# Altium project ePBR23_ACU_Latching.PrjPCB (part 1 of 2)
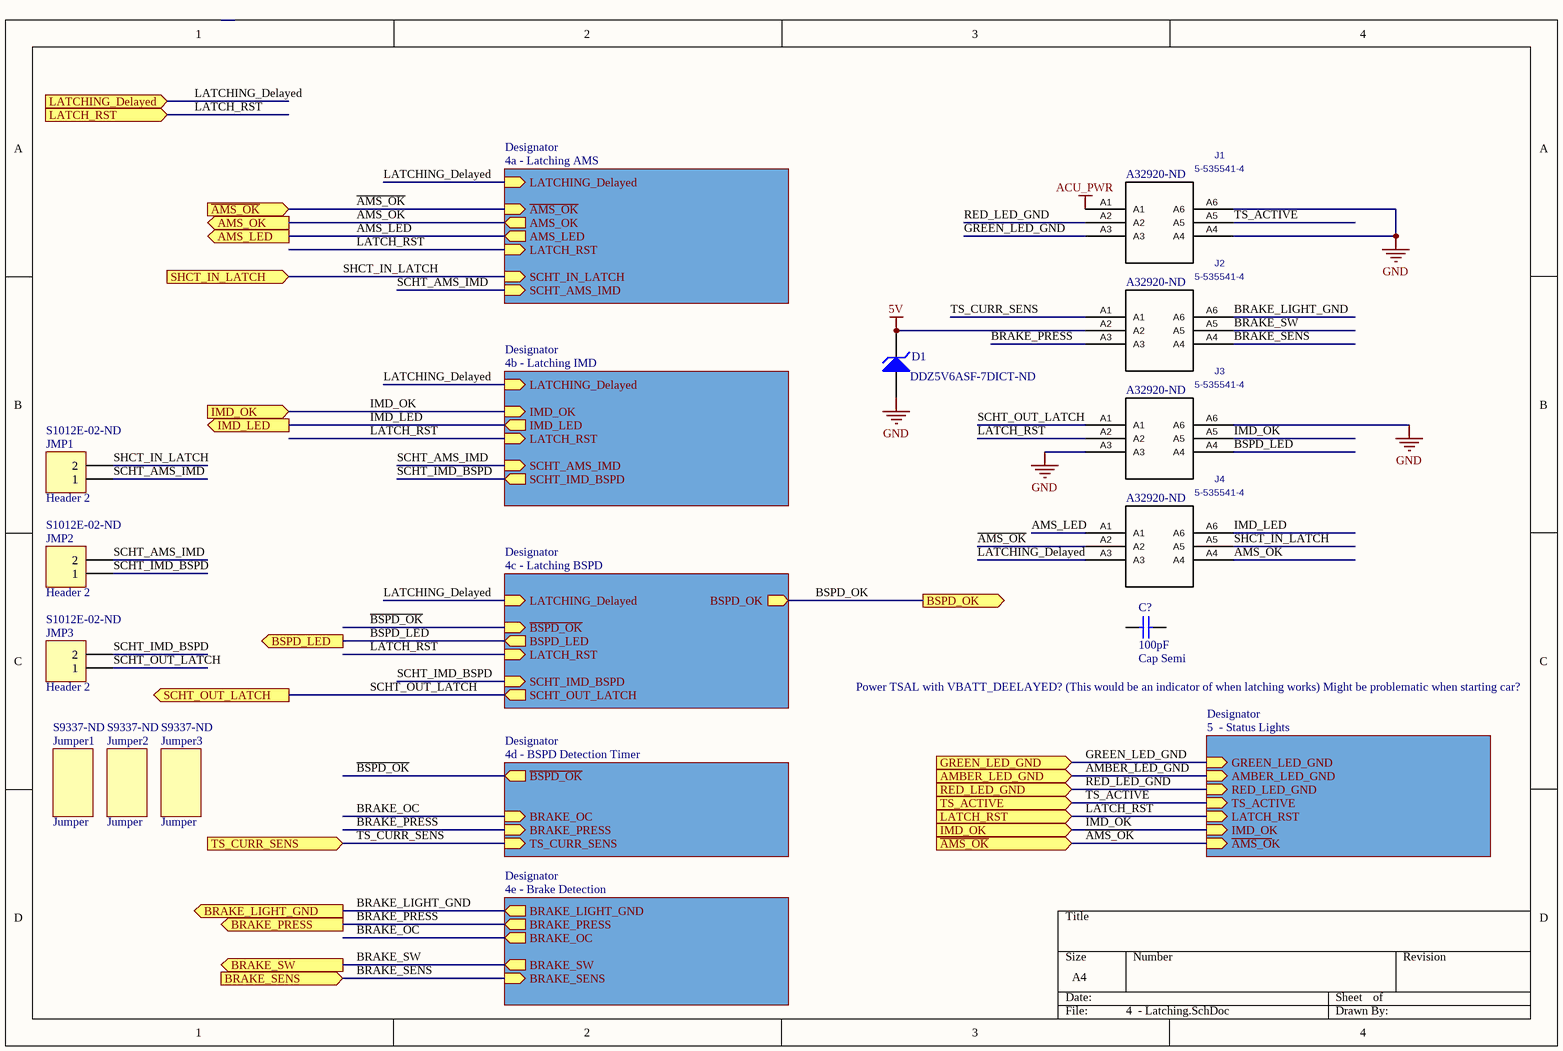
[diagram p0: 4  - Latching.SchDoc]
7 sheets, 102 parts. Net scope: hierarchical (ports join the sheet entries above them; power ports are global).
Board files: ePBR23_ACU_Latching_rev0.PcbDoc, ePBR20_ACU_Latching_rev0.PcbDoc
Sheets:
  4  - Latching.SchDoc
    Designator = 4b - Latching IMD.SchDoc
    Designator = 4c - Latching BSPD.SchDoc
    Designator = 4a - Latching AMS.SchDoc
    Designator = 4d - BSPD Detection Timer.SchDoc
    Designator = 4e - Brake Detection.SchDoc
  5  - TSAL.SchDoc

## Sheet 4  - Latching.SchDoc
size A4

### Parts
C?  Cap Semi  value 100pF  [1608[0603]]
D1  Supplier Part Number 1: DDZ5V6ASF-7DICT-ND  [DIODE_SOD323_101]  (hidden comment: D Zener)
J1  5-535541-4  Supplier Part Number 1: A32920-ND  [5-535541-4_5-535541-4(Primary)]
J2  5-535541-4  Supplier Part Number 1: A32920-ND  [5-535541-4_5-535541-4(Primary)]
J3  5-535541-4  Supplier Part Number 1: A32920-ND  [5-535541-4_5-535541-4(Primary)]
J4  5-535541-4  Supplier Part Number 1: A32920-ND  [5-535541-4_5-535541-4(Primary)]
JMP1  Header 2  Supplier Part Number 1: S1012E-02-ND  [2Pin Jumper]
JMP2  Header 2  Supplier Part Number 1: S1012E-02-ND  [2Pin Jumper]
JMP3  Header 2  Supplier Part Number 1: S1012E-02-ND  [2Pin Jumper]
Jumper1  Jumper  Supplier Part Number 1: S9337-ND
Jumper2  Jumper  Supplier Part Number 1: S9337-ND
Jumper3  Jumper  Supplier Part Number 1: S9337-ND

### Sub-sheets
Designator = 4b - Latching IMD: LATCHING_Delayed (in), IMD_LED (out), LATCH_RST (in), SCHT_AMS_IMD (in), SCHT_IMD_BSPD (out), IMD_OK (in)
Designator = 4c - Latching BSPD: LATCHING_Delayed (in), BSPD_LED (out), LATCH_RST (in), SCHT_IMD_BSPD (in), SCHT_OUT_LATCH (out), ~{BSPD_OK} (in), BSPD_OK (out)
Designator = 4a - Latching AMS: LATCHING_Delayed (in), ~{AMS_OK} (in), AMS_LED (out), LATCH_RST (in), SCHT_IN_LATCH (in), SCHT_AMS_IMD (in), AMS_OK (out)
Designator = 4d - BSPD Detection Timer: ~{BSPD_OK} (out), TS_CURR_SENS (in), BRAKE_PRESS (in), BRAKE_OC (in)
Designator = 4e - Brake Detection: BRAKE_LIGHT_GND (out), BRAKE_PRESS (out), BRAKE_SENS (in), BRAKE_OC (out), BRAKE_SW (out)
Designator = 5  - Status Lights (file not in this document): RED_LED_GND (in), TS_ACTIVE (in), LATCH_RST (in), AMBER_LED_GND (in), GREEN_LED_GND (in), IMD_OK (in), ~{AMS_O}K (in)

### Ports
AMBER_LED_GND (in), AMS_LED (out), AMS_OK (out), BRAKE_LIGHT_GND (out), BRAKE_PRESS (out), BRAKE_SENS (in), BRAKE_SW (out), BSPD_LED (out), BSPD_OK (out), GREEN_LED_GND (in), IMD_LED (out), IMD_OK (in), LATCH_RST (in), LATCHING_Delayed (in), RED_LED_GND (in), SCHT_OUT_LATCH (out), SHCT_IN_LATCH (in), TS_ACTIVE (in), TS_CURR_SENS (in), ~{AMS_OK} (in)

### Nets
5V: D1.2(K) J2.A2
ACU_PWR: J1.A1
GND: D1.1(A) J1.A4 J1.A6 J3.A3 J3.A6
LATCHING_Delayed: J4.A3 ; port LATCHING_Delayed, sheet Designator/LATCHING_Delayed, sheet Designator/LATCHING_Delayed, sheet Designator/LATCHING_Delayed
~{AMS_OK}: J4.A2 ; port ~{AMS_OK}, sheet Designator/~{AMS_OK}, sheet Designator/~{AMS_O}K
AMBER_LED_GND: port AMBER_LED_GND, sheet Designator/AMBER_LED_GND
AMS_LED: J4.A1 ; port AMS_LED, sheet Designator/AMS_LED
AMS_OK: J4.A4 ; port AMS_OK, sheet Designator/AMS_OK
~{BSPD_OK}: sheet Designator/~{BSPD_OK}, sheet Designator/~{BSPD_OK}
BRAKE_LIGHT_GND: J2.A6 ; port BRAKE_LIGHT_GND, sheet Designator/BRAKE_LIGHT_GND
BRAKE_OC: sheet Designator/BRAKE_OC, sheet Designator/BRAKE_OC
BRAKE_PRESS: J2.A3 ; port BRAKE_PRESS, sheet Designator/BRAKE_PRESS, sheet Designator/BRAKE_PRESS
BRAKE_SENS: J2.A4 ; port BRAKE_SENS, sheet Designator/BRAKE_SENS
BRAKE_SW: J2.A5 ; port BRAKE_SW, sheet Designator/BRAKE_SW
BSPD_LED: J3.A4 ; port BSPD_LED, sheet Designator/BSPD_LED
BSPD_OK: port BSPD_OK, sheet Designator/BSPD_OK
GREEN_LED_GND: J1.A3 ; port GREEN_LED_GND, sheet Designator/GREEN_LED_GND
IMD_LED: J4.A6 ; port IMD_LED, sheet Designator/IMD_LED
IMD_OK: J3.A5 ; port IMD_OK, sheet Designator/IMD_OK, sheet Designator/IMD_OK
LATCH_RST: J3.A2 ; port LATCH_RST, sheet Designator/LATCH_RST, sheet Designator/LATCH_RST, sheet Designator/LATCH_RST, sheet Designator/LATCH_RST
RED_LED_GND: J1.A2 ; port RED_LED_GND, sheet Designator/RED_LED_GND
SCHT_AMS_IMD: JMP1.1 JMP2.2 ; sheet Designator/SCHT_AMS_IMD, sheet Designator/SCHT_AMS_IMD
SCHT_IMD_BSPD: JMP2.1 JMP3.2 ; sheet Designator/SCHT_IMD_BSPD, sheet Designator/SCHT_IMD_BSPD
SCHT_OUT_LATCH: J3.A1 JMP3.1 ; port SCHT_OUT_LATCH, sheet Designator/SCHT_OUT_LATCH
SHCT_IN_LATCH: J4.A5 JMP1.2 ; port SHCT_IN_LATCH, sheet Designator/SCHT_IN_LATCH  [project net SCHT_IN_LATCH]
TS_ACTIVE: J1.A5 ; port TS_ACTIVE, sheet Designator/TS_ACTIVE
TS_CURR_SENS: J2.A1 ; port TS_CURR_SENS, sheet Designator/TS_CURR_SENS

Not connected (* = marked no-connect by the designer): C? 1 2

### Notes on the sheet
- Power TSAL with VBATT_DEELAYED? (This would be an indicator of when latching works) Might be problematic when starting car?

### Library data of the parts
C? = Cap Semi: Capacitor (Semiconductor SIM Model); Published: 8-Jun-2000; LatestRevisionDate: 29-May-2009; LatestRevisionNote: IPC-7351 Footprint Added.; PackageReference: C1206; Publisher: Altium Limited; PackageDescription: Chip Capacitor
D1 = D Zener: Zener Diode; Published: 8-Jun-2000; LatestRevisionDate: 17-Jul-2002; LatestRevisionNote: Re-released for DXP Platform.; PackageReference: DIODE-0.7; Publisher: Altium Limited; PackageDescription: Diode, Thru-Hole; 2 Leads; 0.7 in Pin Spacing; Supplier 1: Digi-Key
J1-J4 = 5-535541-4: C: Copyright (C) 2015 Accelerated Designs. All rights reserved; Vendor: TE Connectivity; Built_By: EMA_UL_Team; Value: 5-535541-4; Manufacturer_Part_Number: 5-535541-4; Supplier 1: Digi-Key
JMP1-JMP3 = Header 2: Header, 2-Pin; Manufacturer: Harwin Inc.; Manufacturer Part Number: M20-9990246; Connector Type: Header, Cuttable; Pitch - Mating: 0.100" (2.54mm); Style: Board to Board or Cable; Shrouding: Unshrouded; Number of Positions: 2; Number of Positions Loaded: All; Contact Length - Mating: 0.240" (6.10mm); Contact Length - Post: 0.118" (3.00mm); Overall Contact Length: 0.460" (11.68mm); Material Flammability Rating: UL94 V-0; Current Rating: 3A per Contact; Mated Stacking Heights: 10.04mm, 10.64mm, 11.04mm, 16.54mm; LatestRevisionDate: 17-Jul-2002; LatestRevisionNote: Re-released for DXP Platform.; Publisher: Altium Limited; RoHS: RoHS Compliant; Category: Connectors, Interconnects; Packaging: Bulk; Part Status: Active; Contact Type: Male Pin; Number of Rows: 1; Row Spacing - Mating: -; Mounting Type: Through Hole; Termination: Solder; Fastening Type: Push-Pull; Insulation Height: 0.100" (2.54mm); Contact Shape: Square; Contact Finish - Mating: Tin; Contact Finish Thickness - Mating: -; Contact Finish - Post: Tin; Contact Material: Brass; Insulation Material: Polyamide (PA6T), Nylon 6T; Features: -; Operating Temperature: -40°C ~ 105°C; Ingress Protection: -; Insulation Color: Black; Voltage Rating: -; Contact Finish Thickness - Post: -; Applications: -; ComponentLink1URL: https://cdn.harwin.com/pdfs/M20-999.pdf; ComponentLink1Description: https://cdn.harwin.com/pdfs/M20-999.pdf; Supplier 1: Digi-Key
Jumper1-Jumper3 = Jumper: Supplier 1: Digi-Key

## Sheet 4b - Latching IMD.SchDoc
size A4
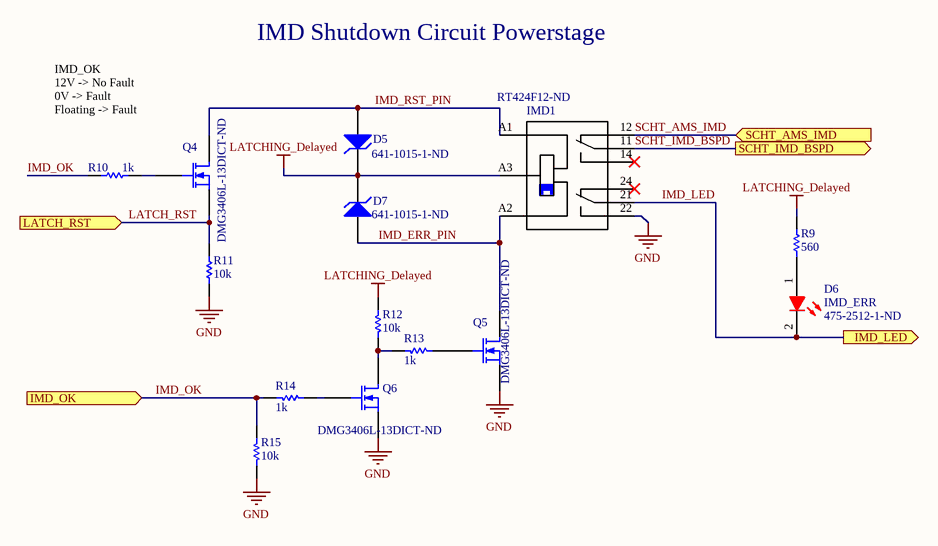
[diagram p1: 4b - Latching IMD.SchDoc]

### Parts
D5  Supplier Part Number 1: 641-1015-1-ND  [DO214AC]  (hidden comment: D Zener)
D6  IMD_ERR  Supplier Part Number 1: 475-2512-1-ND  [TOSH-0603LED_RED_V]
D7  Supplier Part Number 1: 641-1015-1-ND  [DO214AC]  (hidden comment: D Zener)
IMD1  Supplier Part Number 1: RT424F12-ND  [TE_5-1393243-4]  (hidden comment: 5-1393243-4)
Q4  Supplier Part Number 1: DMG3406L-13DICT-ND  [SOT-23_N]
Q5  Supplier Part Number 1: DMG3406L-13DICT-ND  [SOT-23_N]
Q6  Supplier Part Number 1: DMG3406L-13DICT-ND  [SOT-23_N]
R9  560  [RESC0603(1608)_L]
R10  value 1k  [1608[0603]]  (hidden comment: Res1)
R11  value 10k  [1608[0603]]  (hidden comment: Res1)
R12  Resistance (Ohms): 10k  [1608[0603]]  (hidden comment: RHM1.0KDCT-ND)
R13  value 1k  [1608[0603]]  (hidden comment: Res1)
R14  value 1k  [1608[0603]]  (hidden comment: Res1)
R15  value 10k  [1608[0603]]  (hidden comment: Res1)

### Ports
IMD_LED (out), IMD_OK (in), LATCH_RST (in), SCHT_AMS_IMD (in), SCHT_IMD_BSPD (out)

### Nets
GND: IMD1.22 Q5.2(S) Q6.2(S) R11.1 R15.2
LATCHING_Delayed: D5.2(K) D7.2(K) IMD1.A3 R9.2 R12.1
IMD_ERR_PIN: D7.1(A) IMD1.A2 Q5.3(D)
IMD_LED: D6.2(K) IMD1.21 ; port IMD_LED
IMD_OK: R10.1 R14.2 R15.1 ; port IMD_OK
IMD_RST_PIN: D5.1(A) IMD1.A1 Q4.3(D)
LATCH_RST: Q4.2(S) R11.2 ; port LATCH_RST
SCHT_AMS_IMD: IMD1.12 ; port SCHT_AMS_IMD
SCHT_IMD_BSPD: IMD1.11 ; port SCHT_IMD_BSPD
NetD6_1: D6.1(A) R9.1
NetQ4_1: Q4.1(G) R10.2
NetQ5_1: Q5.1(G) R13.1
NetQ6_1: Q6.1(G) R14.1
NetQ6_3: Q6.3(D) R12.2 R13.2

Not connected (* = marked no-connect by the designer): IMD1 14* 24*

### Notes on the sheet
- IMD Shutdown Circuit Powerstage
- IMD_OK
  12V -> No Fault
  0V -> Fault
  Floating -> Fault

### Library data of the parts
D5 D7 = D Zener: Zener Diode; Published: 8-Jun-2000; LatestRevisionDate: 17-Jul-2002; LatestRevisionNote: Re-released for DXP Platform.; PackageReference: DIODE-0.7; Publisher: Altium Limited; PackageDescription: Diode, Thru-Hole; 2 Leads; 0.7 in Pin Spacing; Supplier 1: Digi-Key
D6 = CMP-0444-00001-1: LED, Red 0603 (1608) 63mCd; Manufacturer: Toshiba; PartNumber: TLSU1008A(T04); Forward Current: 25 mA; Power Dissipation: 60 mW; Packing Type: Reel; Reverse Voltage: 4 V; Mounting Technology: Surface Mount; PackageDescription: 2-Pin SMT LED, 1.6 x 0.8 mm Pitch; ComponentLink1URL: http://www.toshiba-components.com/; ComponentLink1Description: Manufacturer URL; PackageReference: 0603LED_RED; ComponentLink2URL: http://www.semicon.toshiba.co.jp/info/docget.jsp?type=datasheet&lang=en&pid=TLSU1008A(T04); ComponentLink2Description: Datasheet; DatasheetVersion: Aug-08; Storage Temperature: -40 to 100 degC; Supplier 1: Digi-Key
IMD1 = 5-1393243-4: Electromechanical Relay 12VDC 240Ohm 15A DPDT __ 29mm 12.7mm 15.7mm__ THT Power Relay; MF: TE Connectivity; TE_purchase_URL: https://www.te.com/usa-en/product-5-1393243-4.html?te_bu=Cor&te_type=disp&te_campaign=seda_glo_cor-seda-global-disp-prtnr-fy19-seda-model-bom-cta_sma-317_1&elqCampaignId=32493; Package: None; MP: 5-1393243-4; Digi-Key_Purchase_URL: *; Digi-Key_Part_Number: *; SnapEDA_Link: https://www.snapeda.com/parts/5-1393243-4/TE%20Connectivity/view-part/?ref=snap; Value: *; Supplier 1: Digi-Key
Q4-Q6 = MOSFET-N: N-Channel MOSFET; Manufacturer: Infineon Technologies; FET Type: MOSFET N-Channel, Metal Oxide; FET Feature: Logic Level Gate; Drain to Source Voltage (Vdss): 30V; Current - Continuous Drain (Id) @ 25°C: 50A (Tc); Rds On (Max) @ Id, Vgs: 7.5 mOhm @ 30A, 10V; Vgs(th) (Max) @ Id: 2.2V @ 250µA; Gate Charge (Qg) @ Vgs: 18nC @ 10V; Input Capacitance (Ciss) @ Vds: 1900pF @ 15V; Power - Max: 47W; Published: 8-Jun-2000; LatestRevisionDate: 17-Jul-2002; LatestRevisionNote: Re-released for DXP Platform.; PackageVersion: 1995/1996; PackageReference: E3; Publisher: Altium Limited; PackageDescription: TO, Flat Index; 3 In-Line, Axial Leads; Body Dia. 4.6mm; Lead Dia. 0.5 mm (max); RoHS: RoHS Compliant; Category: Discrete Semiconductor Products; Packaging: Cut Tape (CT); Mounting Type: Surface Mount; Package / Case: TO-252-3, DPak (2 Leads + Tab), SC-63; Supplier Device Package: PG-TO252-3; ComponentLink1URL: http://www.infineon.com/dgdl/Infineon-IPD075N03LG-DS-v02_01-en.pdf?folderId=5546d4694909da4801490a07012f053b&fileId=db3a30431936bc4b011951d824f83aeb; ComponentLink1Description: http://www.infineon.com/dgdl/Infineon-IPD075N03LG-DS-v02_01-en.pdf?folderId=5546d4694909da4801490a07012f053b&fileId=db3a30431936bc4b011951d824f83aeb; ComponentLink2URL: http://www.semicon.toshiba.co.jp/info/docget.jsp?type=datasheet&lang=en&pid=SSM3K329R; ComponentLink2Description: http://www.semicon.toshiba.co.jp/info/docget.jsp?type=datasheet&lang=en&pid=SSM3K329R; Supplier 1: Digi-Key
R9 = CMP-1591-00001-1: 0603 (1608 Metric) Chip Resistor; Case-Metric: 1608; Case-EIA: 0603; PackageReference: RESC0603(1608); Supplier 1: Digi-Key; Supplier Part Number 1: A129685CT-ND
R10 R13 R14 = Res1: RES SMD 100 OHM 5% 1/4W 0603; Manufacturer: Rohm Semiconductor; Manufacturer Part Number: ESR03EZPJ101; Resistance (Ohms): 100; Power (Watts): 0.25W, 1/4W; Temperature Coefficient: ±200ppm/°C; Published: 8-Jun-2000; LatestRevisionDate: 17-Jul-2002; LatestRevisionNote: Re-released for DXP Platform.; PackageReference: AXIAL-0.3; Publisher: Altium Limited; PackageDescription: Axial Device, Thru-Hole; 2 Leads; 0.3 in Pin Spacing; RoHS: RoHS Compliant; Category: Resistors; Stock 1: 57430; Pricing 1: 1=0.15, 10=0.119, 25=0.0824, 50=0.0642, 100=0.0458, 250=0.03568, 500=0.02836, 1000=0.02012 (CAD); Packaging: Cut Tape (CT); Part Status: Active; Tolerance: ±5%; Composition: Thick Film; Features: Automotive AEC-Q200, Pulse Withstanding; Operating Temperature: -55°C ~ 155°C; Package / Case: 0603 (1608 Metric); Supplier Device Package: 0603; Size / Dimension: 0.063" L x 0.031" W (1.60mm x 0.80mm); Height - Seated (Max): 0.022" (0.55mm); Failure Rate: -; ComponentLink1URL: http://rohmfs.rohm.com/en/products/databook/datasheet/passive/resistor/chip_resistor/esr.pdf; ComponentLink1Description: http://rohmfs.rohm.com/en/products/databook/datasheet/passive/resistor/chip_resistor/esr.pdf; Supplier 1: Digi-Key; Supplier Part Number 1: 311-1.0KGRCT-ND
R11 = Res1: RES SMD 10K OHM 5% 1/4W 0603; Manufacturer: Rohm Semiconductor; Manufacturer Part Number: ESR03EZPJ103; Power (Watts): 0.25W, 1/4W; Temperature Coefficient: ±200ppm/°C; Published: 8-Jun-2000; LatestRevisionDate: 17-Jul-2002; LatestRevisionNote: Re-released for DXP Platform.; PackageReference: AXIAL-0.3; Publisher: Altium Limited; PackageDescription: Axial Device, Thru-Hole; 2 Leads; 0.3 in Pin Spacing; RoHS: RoHS Compliant; Category: Resistors; Stock 1: 0; Pricing 1: 1=0.15, 10=0.119, 25=0.0824, 50=0.0642, 100=0.0458, 250=0.03568, 500=0.02836, 1000=0.02012 (CAD); Packaging: Cut Tape (CT); Resistance (Ohms): 10k; Tolerance: ±5%; Composition: Thick Film; Features: Automotive AEC-Q200, Pulse Withstanding; Operating Temperature: -55°C ~ 155°C; Package / Case: 0603 (1608 Metric); Supplier Device Package: 0603 (1608 Metric); Size / Dimension: 0.063" L x 0.031" W (1.60mm x 0.80mm); Height: 0.022" (0.55mm); Number of Terminations: 2; ComponentLink1URL: http://rohmfs.rohm.com/en/products/databook/datasheet/passive/resistor/chip_resistor/esr.pdf; ComponentLink1Description: http://rohmfs.rohm.com/en/products/databook/datasheet/passive/resistor/chip_resistor/esr.pdf; Part Status: Active; Height - Seated (Max): 0.022" (0.55mm); Failure Rate: -; Supplier 1: Digi-Key; Supplier Part Number 1: 311-10KGRCT-ND
R12 = Res1: RES SMD 1.0K OHM 5% 1/4W 0603; Manufacturer: Rohm Semiconductor; Manufacturer Part Number: ESR03EZPJ102; Power (Watts): 0.25W, 1/4W; Temperature Coefficient: ±200ppm/°C; RoHS: RoHS Compliant; Category: Resistors; Stock 1: 220; Pricing 1: 1=0.15, 10=0.119, 25=0.0824, 50=0.0642, 100=0.0458, 250=0.03568, 500=0.02836, 1000=0.02012 (CAD); Packaging: Cut Tape (CT); Part Status: Active; Tolerance: ±5%; Composition: Thick Film; Features: Automotive AEC-Q200, Pulse Withstanding; Operating Temperature: -55°C ~ 155°C; Package / Case: 0603 (1608 Metric); Supplier Device Package: 0603; Size / Dimension: 0.063" L x 0.031" W (1.60mm x 0.80mm); Height - Seated (Max): 0.022" (0.55mm); Failure Rate: -; ComponentLink1URL: http://rohmfs.rohm.com/en/products/databook/datasheet/passive/resistor/chip_resistor/esr.pdf; ComponentLink1Description: http://rohmfs.rohm.com/en/products/databook/datasheet/passive/resistor/chip_resistor/esr.pdf; Supplier 1: Digi-Key; Supplier Part Number 1: 311-10KGRCT-ND
R15 = Res1: RES SMD 2.2K OHM 5% 1/4W 0603; Manufacturer: Rohm Semiconductor; Manufacturer Part Number: ESR03EZPJ222; Power (Watts): 0.25W, 1/4W; Temperature Coefficient: ±200ppm/°C; Published: 8-Jun-2000; LatestRevisionDate: 17-Jul-2002; LatestRevisionNote: Re-released for DXP Platform.; PackageReference: AXIAL-0.3; Publisher: Altium Limited; PackageDescription: Axial Device, Thru-Hole; 2 Leads; 0.3 in Pin Spacing; RoHS: RoHS Compliant; Category: Resistors; Stock 1: 17564; Pricing 1: 1=0.15, 10=0.121, 25=0.0832, 100=0.0463, 250=0.03604, 500=0.02866, 1000=0.02033 (CAD); Packaging: Cut Tape (CT); Resistance (Ohms): 2.2k; Tolerance: ±5%; Composition: Thick Film; Features: Automotive AEC-Q200, Pulse Withstanding; Operating Temperature: -55°C ~ 155°C; Package / Case: 0603 (1608 Metric); Supplier Device Package: 0603 (1608 Metric); Size / Dimension: 0.063" L x 0.031" W (1.60mm x 0.80mm); Height: 0.022" (0.55mm); Number of Terminations: 2; ComponentLink1URL: http://rohmfs.rohm.com/en/products/databook/datasheet/passive/resistor/chip_resistor/esr.pdf; ComponentLink1Description: http://rohmfs.rohm.com/en/products/databook/datasheet/passive/resistor/chip_resistor/esr.pdf; Supplier 1: Digi-Key; Supplier Part Number 1: 311-10KGRCT-ND

## Sheet 4c - Latching BSPD.SchDoc
size A4
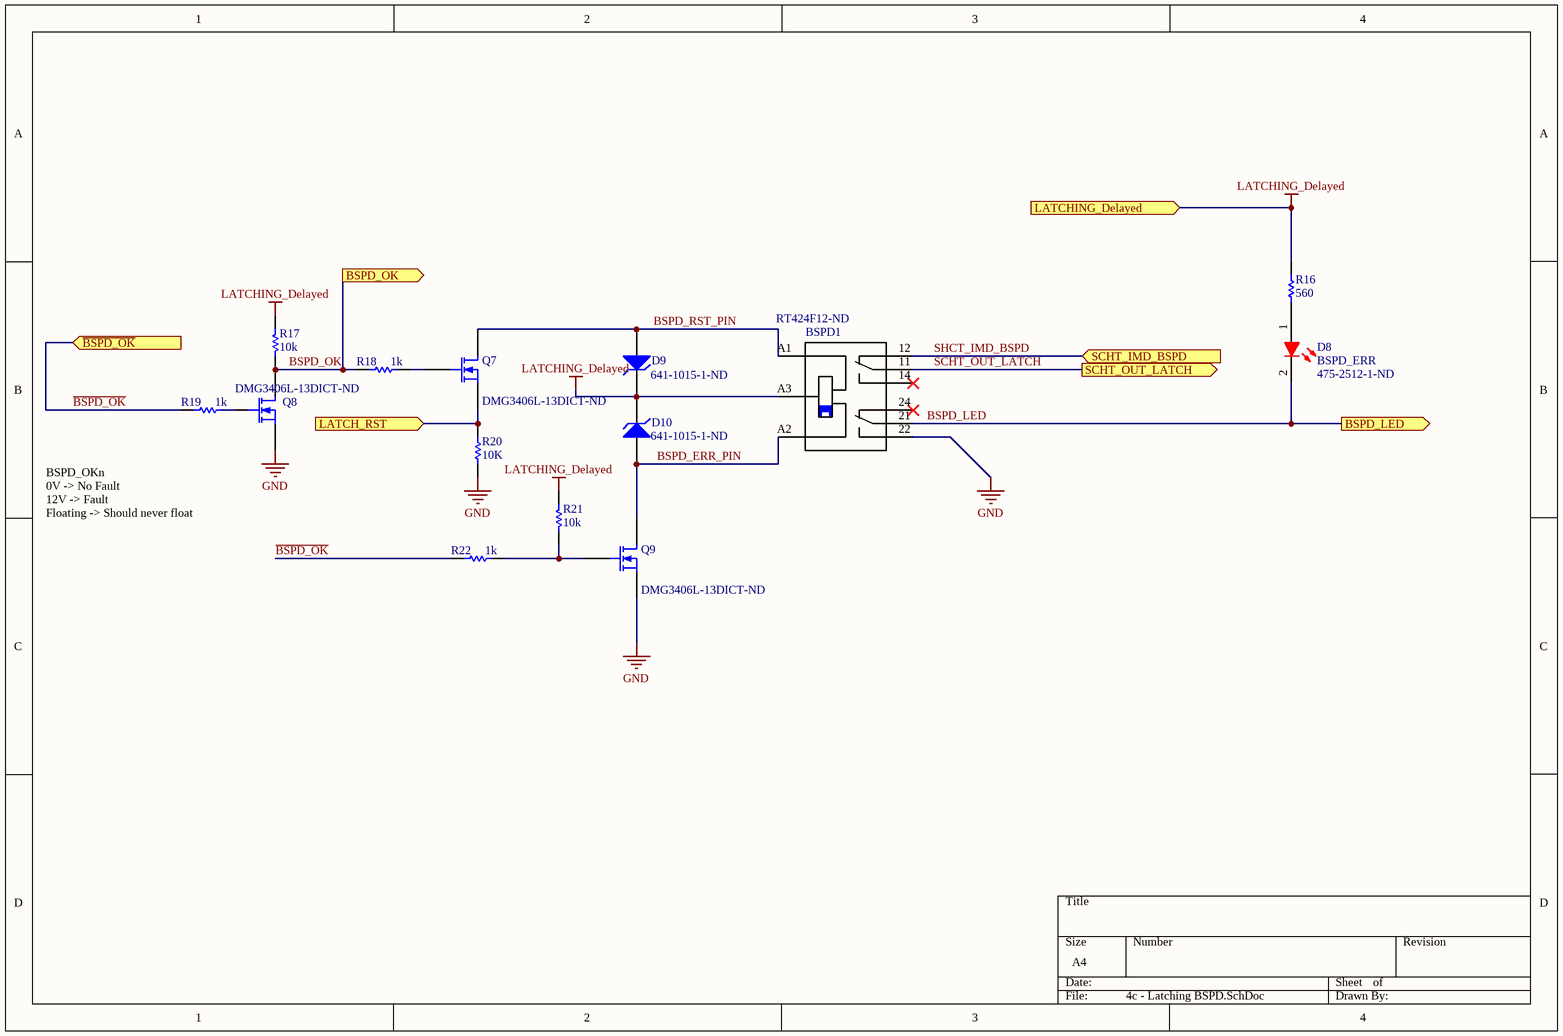
[diagram p2: 4c - Latching BSPD.SchDoc]

### Parts
(Parts that share a designator on the sheet are numbered #1, #2 ... from top to bottom, then left to right.)
BSPD1  Supplier Part Number 1: RT424F12-ND  [TE_5-1393243-4]  (hidden comment: 5-1393243-4)
D8  BSPD_ERR  Supplier Part Number 1: 475-2512-1-ND  [TOSH-0603LED_RED_V]
D9  Supplier Part Number 1: 641-1015-1-ND  [DO214AC]  (hidden comment: D Zener)
D10  Supplier Part Number 1: 641-1015-1-ND  [DO214AC]  (hidden comment: D Zener)
Q7  Supplier Part Number 1: DMG3406L-13DICT-ND  [SOT-23_N]
Q8  Supplier Part Number 1: DMG3406L-13DICT-ND  [SOT-23_N]
Q9  Supplier Part Number 1: DMG3406L-13DICT-ND  [SOT-23_N]
R16  560  [RESC0603(1608)_L]
R17  Resistance (Ohms): 10k  [1608[0603]]  (hidden comment: RHM1.0KDCT-ND)
R18  value 1k  [1608[0603]]  (hidden comment: Res1)
R19  value 1k  [1608[0603]]  (hidden comment: Res1)
R20#1  value 10K  [1608[0603]]  (hidden comment: Res1)
R21#1  Resistance (Ohms): 10k  [1608[0603]]  (hidden comment: RHM1.0KDCT-ND)
R22  value 1k  [1608[0603]]  (hidden comment: Res1)

### Ports
BSPD_LED (out), BSPD_OK (out), LATCH_RST (in), LATCHING_Delayed (in), SCHT_IMD_BSPD (in), SCHT_OUT_LATCH (out), ~{BSPD_OK} (in)

### Nets
GND: BSPD1.22 Q8.2(S) Q9.2(S) R20#1.1
LATCHING_Delayed: BSPD1.A3 D9.2(K) D10.2(K) R16.2 R17.1 R21#1.1 ; port LATCHING_Delayed
~{BSPD_OK}: R19.1 R22.1 ; port ~{BSPD_OK}
BSPD_ERR_PIN: BSPD1.A2 D10.1(A) Q9.3(D)
BSPD_LED: BSPD1.21 D8.2(K) ; port BSPD_LED
BSPD_OK: Q8.3(D) R17.2 R18.1 ; port BSPD_OK
BSPD_RST_PIN: BSPD1.A1 D9.1(A) Q7.3(D)
LATCH_RST: Q7.2(S) R20#1.2 ; port LATCH_RST
SCHT_OUT_LATCH: BSPD1.11 ; port SCHT_OUT_LATCH
SHCT_IMD_BSPD: BSPD1.12 ; port SCHT_IMD_BSPD  [project net SCHT_IMD_BSPD]
NetD8_1: D8.1(A) R16.1
NetQ7_1: Q7.1(G) R18.2
NetQ8_1: Q8.1(G) R19.2
NetQ9_1: Q9.1(G) R21#1.2 R22.2

Not connected (* = marked no-connect by the designer): BSPD1 14* 24*

### Notes on the sheet
- BSPD_OKn
  0V -> No Fault
  12V -> Fault
  Floating -> Should never float

### Library data of the parts
BSPD1 = 5-1393243-4: as IMD1 on sheet 4b - Latching IMD; TE_purchase_URL: https://www.te.com/usa-en/product-5-1393243-4.html?te_bu=Cor&te_type=disp&te_campaign=seda_glo_cor-seda-global-disp-prtnr-fy19-seda-model-bom-cta_sma-317_1&elqCampaignId=32493; Package: None; MP: 5-1393243-4; Digi-Key_Purchase_URL: *; Digi-Key_Part_Number: *; SnapEDA_Link: https://www.snapeda.com/parts/5-1393243-4/TE%20Connectivity/view-part/?ref=snap; Value: *; Supplier 1: Digi-Key
D8 = CMP-0444-00001-1: as D6 on sheet 4b - Latching IMD; Mounting Technology: Surface Mount; PackageDescription: 2-Pin SMT LED, 1.6 x 0.8 mm Pitch; ComponentLink1URL: http://www.toshiba-components.com/; ComponentLink1Description: Manufacturer URL; PackageReference: 0603LED_RED; ComponentLink2URL: http://www.semicon.toshiba.co.jp/info/docget.jsp?type=datasheet&lang=en&pid=TLSU1008A(T04); ComponentLink2Description: Datasheet; DatasheetVersion: Aug-08; Storage Temperature: -40 to 100 degC; Supplier 1: Digi-Key
D9 D10 = D Zener: Zener Diode; Published: 8-Jun-2000; LatestRevisionDate: 17-Jul-2002; LatestRevisionNote: Re-released for DXP Platform.; PackageReference: DIODE-0.7; Publisher: Altium Limited; PackageDescription: Diode, Thru-Hole; 2 Leads; 0.7 in Pin Spacing; Supplier 1: Digi-Key
Q7-Q9 = MOSFET-N: as Q4 on sheet 4b - Latching IMD; Published: 8-Jun-2000; LatestRevisionDate: 17-Jul-2002; LatestRevisionNote: Re-released for DXP Platform.; PackageVersion: 1995/1996; PackageReference: E3; Publisher: Altium Limited; PackageDescription: TO, Flat Index; 3 In-Line, Axial Leads; Body Dia. 4.6mm; Lead Dia. 0.5 mm (max); RoHS: RoHS Compliant; Category: Discrete Semiconductor Products; Packaging: Cut Tape (CT); Mounting Type: Surface Mount; Package / Case: TO-252-3, DPak (2 Leads + Tab), SC-63; Supplier Device Package: PG-TO252-3; ComponentLink1URL: http://www.infineon.com/dgdl/Infineon-IPD075N03LG-DS-v02_01-en.pdf?folderId=5546d4694909da4801490a07012f053b&fileId=db3a30431936bc4b011951d824f83aeb; ComponentLink1Description: http://www.infineon.com/dgdl/Infineon-IPD075N03LG-DS-v02_01-en.pdf?folderId=5546d4694909da4801490a07012f053b&fileId=db3a30431936bc4b011951d824f83aeb; ComponentLink2URL: http://www.semicon.toshiba.co.jp/info/docget.jsp?type=datasheet&lang=en&pid=SSM3K329R; ComponentLink2Description: http://www.semicon.toshiba.co.jp/info/docget.jsp?type=datasheet&lang=en&pid=SSM3K329R; Supplier 1: Digi-Key
R16 = CMP-1591-00001-1: as R9 on sheet 4b - Latching IMD; PackageReference: RESC0603(1608); Supplier 1: Digi-Key; Supplier Part Number 1: A129685CT-ND
R17 R21#1 = Res1: as R12 on sheet 4b - Latching IMD; RoHS: RoHS Compliant; Category: Resistors; Stock 1: 220; Pricing 1: 1=0.15, 10=0.119, 25=0.0824, 50=0.0642, 100=0.0458, 250=0.03568, 500=0.02836, 1000=0.02012 (CAD); Packaging: Cut Tape (CT); Part Status: Active; Tolerance: ±5%; Composition: Thick Film; Features: Automotive AEC-Q200, Pulse Withstanding; Operating Temperature: -55°C ~ 155°C; Package / Case: 0603 (1608 Metric); Supplier Device Package: 0603; Size / Dimension: 0.063" L x 0.031" W (1.60mm x 0.80mm); Height - Seated (Max): 0.022" (0.55mm); Failure Rate: -; ComponentLink1URL: http://rohmfs.rohm.com/en/products/databook/datasheet/passive/resistor/chip_resistor/esr.pdf; ComponentLink1Description: http://rohmfs.rohm.com/en/products/databook/datasheet/passive/resistor/chip_resistor/esr.pdf; Supplier 1: Digi-Key; Supplier Part Number 1: 311-10KGRCT-ND
R18 R19 R22 = Res1: as R10 on sheet 4b - Latching IMD; Published: 8-Jun-2000; LatestRevisionDate: 17-Jul-2002; LatestRevisionNote: Re-released for DXP Platform.; PackageReference: AXIAL-0.3; Publisher: Altium Limited; PackageDescription: Axial Device, Thru-Hole; 2 Leads; 0.3 in Pin Spacing; RoHS: RoHS Compliant; Category: Resistors; Stock 1: 57430; Pricing 1: 1=0.15, 10=0.119, 25=0.0824, 50=0.0642, 100=0.0458, 250=0.03568, 500=0.02836, 1000=0.02012 (CAD); Packaging: Cut Tape (CT); Part Status: Active; Tolerance: ±5%; Composition: Thick Film; Features: Automotive AEC-Q200, Pulse Withstanding; Operating Temperature: -55°C ~ 155°C; Package / Case: 0603 (1608 Metric); Supplier Device Package: 0603; Size / Dimension: 0.063" L x 0.031" W (1.60mm x 0.80mm); Height - Seated (Max): 0.022" (0.55mm); Failure Rate: -; ComponentLink1URL: http://rohmfs.rohm.com/en/products/databook/datasheet/passive/resistor/chip_resistor/esr.pdf; ComponentLink1Description: http://rohmfs.rohm.com/en/products/databook/datasheet/passive/resistor/chip_resistor/esr.pdf; Supplier 1: Digi-Key; Supplier Part Number 1: 311-1.0KGRCT-ND
R20#1 = Res1: as R11 on sheet 4b - Latching IMD; Published: 8-Jun-2000; LatestRevisionDate: 17-Jul-2002; LatestRevisionNote: Re-released for DXP Platform.; PackageReference: AXIAL-0.3; Publisher: Altium Limited; PackageDescription: Axial Device, Thru-Hole; 2 Leads; 0.3 in Pin Spacing; RoHS: RoHS Compliant; Category: Resistors; Stock 1: 0; Pricing 1: 1=0.15, 10=0.119, 25=0.0824, 50=0.0642, 100=0.0458, 250=0.03568, 500=0.02836, 1000=0.02012 (CAD); Packaging: Cut Tape (CT); Resistance (Ohms): 10k; Tolerance: ±5%; Composition: Thick Film; Features: Automotive AEC-Q200, Pulse Withstanding; Operating Temperature: -55°C ~ 155°C; Package / Case: 0603 (1608 Metric); Supplier Device Package: 0603 (1608 Metric); Size / Dimension: 0.063" L x 0.031" W (1.60mm x 0.80mm); Height: 0.022" (0.55mm); Number of Terminations: 2; ComponentLink1URL: http://rohmfs.rohm.com/en/products/databook/datasheet/passive/resistor/chip_resistor/esr.pdf; ComponentLink1Description: http://rohmfs.rohm.com/en/products/databook/datasheet/passive/resistor/chip_resistor/esr.pdf; Part Status: Active; Height - Seated (Max): 0.022" (0.55mm); Failure Rate: -; Supplier 1: Digi-Key; Supplier Part Number 1: 311-10KGRCT-ND

## Sheet 4a - Latching AMS.SchDoc
size A4
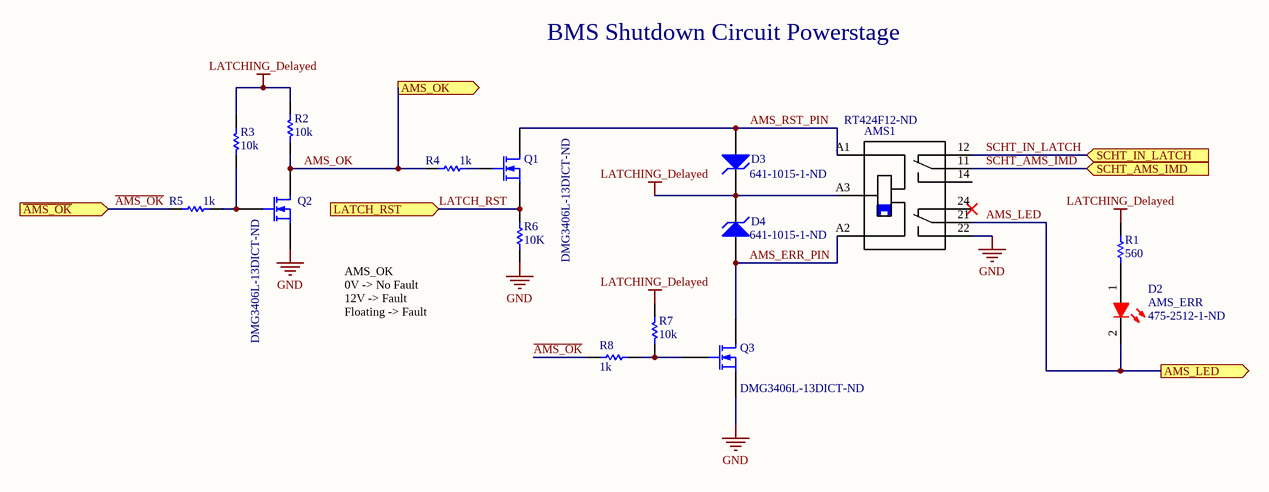
[diagram p3: 4a - Latching AMS.SchDoc]

### Parts
(Parts that share a designator on the sheet are numbered #1, #2 ... from top to bottom, then left to right.)
AMS1  Supplier Part Number 1: RT424F12-ND  [TE_5-1393243-4]  (hidden comment: 5-1393243-4)
D2  AMS_ERR  Supplier Part Number 1: 475-2512-1-ND  [TOSH-0603LED_RED_V]
D3  Supplier Part Number 1: 641-1015-1-ND  [DO214AC]  (hidden comment: D Zener)
D4#1  Supplier Part Number 1: 641-1015-1-ND  [DO214AC]  (hidden comment: D Zener)
Q1  Supplier Part Number 1: DMG3406L-13DICT-ND  [SOT-23_N]
Q2  Supplier Part Number 1: DMG3406L-13DICT-ND  [SOT-23_N]
Q3  Supplier Part Number 1: DMG3406L-13DICT-ND  [SOT-23_N]
R1  560  [RESC0603(1608)_L]
R2  Resistance (Ohms): 10k  [1608[0603]]  (hidden comment: RHM1.0KDCT-ND)
R3  Resistance (Ohms): 10k  [1608[0603]]  (hidden comment: RHM1.0KDCT-ND)
R4  value 1k  [1608[0603]]  (hidden comment: Res1)
R5  value 1k  [1608[0603]]  (hidden comment: Res1)
R6  value 10K  [1608[0603]]  (hidden comment: Res1)
R7  Resistance (Ohms): 10k  [1608[0603]]  (hidden comment: RHM1.0KDCT-ND)
R8  1k  [1608[0603]]

### Ports
AMS_LED (out), AMS_OK (out), LATCH_RST (in), SCHT_AMS_IMD (in), SCHT_IN_LATCH (in), ~{AMS_OK} (in)

### Nets
GND: AMS1.22 Q2.2(S) Q3.2(S) R6.1
LATCHING_Delayed: AMS1.A3 D3.2(K) D4#1.2(K) R1.2 R2.1 R3.1 R7.1
~{AMS_OK}: R5.1 R8.1 ; port ~{AMS_OK}
AMS_ERR_PIN: AMS1.A2 D4#1.1(A) Q3.3(D)
AMS_LED: AMS1.21 D2.2(K) ; port AMS_LED
AMS_OK: Q2.3(D) R2.2 R4.1 ; port AMS_OK
AMS_RST_PIN: AMS1.A1 D3.1(A) Q1.3(D)
LATCH_RST: Q1.2(S) R6.2 ; port LATCH_RST
SCHT_AMS_IMD: AMS1.11 ; port SCHT_AMS_IMD
SCHT_IN_LATCH: AMS1.12 ; port SCHT_IN_LATCH
NetD2_1: D2.1(A) R1.1
NetQ1_1: Q1.1(G) R4.2
NetQ2_1: Q2.1(G) R3.2 R5.2
NetQ3_1: Q3.1(G) R7.2 R8.2

Not connected (* = marked no-connect by the designer): AMS1 14 24*

### Notes on the sheet
- BMS Shutdown Circuit Powerstage
- AMS_OK
  0V -> No Fault
  12V -> Fault
  Floating -> Fault

### Library data of the parts
AMS1 = 5-1393243-4: as IMD1 on sheet 4b - Latching IMD; TE_purchase_URL: https://www.te.com/usa-en/product-5-1393243-4.html?te_bu=Cor&te_type=disp&te_campaign=seda_glo_cor-seda-global-disp-prtnr-fy19-seda-model-bom-cta_sma-317_1&elqCampaignId=32493; Package: None; MP: 5-1393243-4; Digi-Key_Purchase_URL: *; Digi-Key_Part_Number: *; SnapEDA_Link: https://www.snapeda.com/parts/5-1393243-4/TE%20Connectivity/view-part/?ref=snap; Value: *; Supplier 1: Digi-Key
D2 = CMP-0444-00001-1: as D6 on sheet 4b - Latching IMD; Mounting Technology: Surface Mount; PackageDescription: 2-Pin SMT LED, 1.6 x 0.8 mm Pitch; ComponentLink1URL: http://www.toshiba-components.com/; ComponentLink1Description: Manufacturer URL; PackageReference: 0603LED_RED; ComponentLink2URL: http://www.semicon.toshiba.co.jp/info/docget.jsp?type=datasheet&lang=en&pid=TLSU1008A(T04); ComponentLink2Description: Datasheet; DatasheetVersion: Aug-08; Storage Temperature: -40 to 100 degC; Supplier 1: Digi-Key
D3 D4#1 = D Zener: Zener Diode; Published: 8-Jun-2000; LatestRevisionDate: 17-Jul-2002; LatestRevisionNote: Re-released for DXP Platform.; PackageReference: DIODE-0.7; Publisher: Altium Limited; PackageDescription: Diode, Thru-Hole; 2 Leads; 0.7 in Pin Spacing; Supplier 1: Digi-Key
Q1-Q3 = MOSFET-N: as Q4 on sheet 4b - Latching IMD; Published: 8-Jun-2000; LatestRevisionDate: 17-Jul-2002; LatestRevisionNote: Re-released for DXP Platform.; PackageVersion: 1995/1996; PackageReference: E3; Publisher: Altium Limited; PackageDescription: TO, Flat Index; 3 In-Line, Axial Leads; Body Dia. 4.6mm; Lead Dia. 0.5 mm (max); RoHS: RoHS Compliant; Category: Discrete Semiconductor Products; Packaging: Cut Tape (CT); Mounting Type: Surface Mount; Package / Case: TO-252-3, DPak (2 Leads + Tab), SC-63; Supplier Device Package: PG-TO252-3; ComponentLink1URL: http://www.infineon.com/dgdl/Infineon-IPD075N03LG-DS-v02_01-en.pdf?folderId=5546d4694909da4801490a07012f053b&fileId=db3a30431936bc4b011951d824f83aeb; ComponentLink1Description: http://www.infineon.com/dgdl/Infineon-IPD075N03LG-DS-v02_01-en.pdf?folderId=5546d4694909da4801490a07012f053b&fileId=db3a30431936bc4b011951d824f83aeb; ComponentLink2URL: http://www.semicon.toshiba.co.jp/info/docget.jsp?type=datasheet&lang=en&pid=SSM3K329R; ComponentLink2Description: http://www.semicon.toshiba.co.jp/info/docget.jsp?type=datasheet&lang=en&pid=SSM3K329R; Supplier 1: Digi-Key
R1 = CMP-1591-00001-1: as R9 on sheet 4b - Latching IMD; PackageReference: RESC0603(1608); Supplier 1: Digi-Key; Supplier Part Number 1: A129685CT-ND
R2 R3 R7 = Res1: as R12 on sheet 4b - Latching IMD; RoHS: RoHS Compliant; Category: Resistors; Stock 1: 220; Pricing 1: 1=0.15, 10=0.119, 25=0.0824, 50=0.0642, 100=0.0458, 250=0.03568, 500=0.02836, 1000=0.02012 (CAD); Packaging: Cut Tape (CT); Part Status: Active; Tolerance: ±5%; Composition: Thick Film; Features: Automotive AEC-Q200, Pulse Withstanding; Operating Temperature: -55°C ~ 155°C; Package / Case: 0603 (1608 Metric); Supplier Device Package: 0603; Size / Dimension: 0.063" L x 0.031" W (1.60mm x 0.80mm); Height - Seated (Max): 0.022" (0.55mm); Failure Rate: -; ComponentLink1URL: http://rohmfs.rohm.com/en/products/databook/datasheet/passive/resistor/chip_resistor/esr.pdf; ComponentLink1Description: http://rohmfs.rohm.com/en/products/databook/datasheet/passive/resistor/chip_resistor/esr.pdf; Supplier 1: Digi-Key; Supplier Part Number 1: 311-10KGRCT-ND
R4 R5 = Res1: as R10 on sheet 4b - Latching IMD; Published: 8-Jun-2000; LatestRevisionDate: 17-Jul-2002; LatestRevisionNote: Re-released for DXP Platform.; PackageReference: AXIAL-0.3; Publisher: Altium Limited; PackageDescription: Axial Device, Thru-Hole; 2 Leads; 0.3 in Pin Spacing; RoHS: RoHS Compliant; Category: Resistors; Stock 1: 57430; Pricing 1: 1=0.15, 10=0.119, 25=0.0824, 50=0.0642, 100=0.0458, 250=0.03568, 500=0.02836, 1000=0.02012 (CAD); Packaging: Cut Tape (CT); Part Status: Active; Tolerance: ±5%; Composition: Thick Film; Features: Automotive AEC-Q200, Pulse Withstanding; Operating Temperature: -55°C ~ 155°C; Package / Case: 0603 (1608 Metric); Supplier Device Package: 0603; Size / Dimension: 0.063" L x 0.031" W (1.60mm x 0.80mm); Height - Seated (Max): 0.022" (0.55mm); Failure Rate: -; ComponentLink1URL: http://rohmfs.rohm.com/en/products/databook/datasheet/passive/resistor/chip_resistor/esr.pdf; ComponentLink1Description: http://rohmfs.rohm.com/en/products/databook/datasheet/passive/resistor/chip_resistor/esr.pdf; Supplier 1: Digi-Key; Supplier Part Number 1: 311-1.0KGRCT-ND
R6 = Res1: as R11 on sheet 4b - Latching IMD; Published: 8-Jun-2000; LatestRevisionDate: 17-Jul-2002; LatestRevisionNote: Re-released for DXP Platform.; PackageReference: AXIAL-0.3; Publisher: Altium Limited; PackageDescription: Axial Device, Thru-Hole; 2 Leads; 0.3 in Pin Spacing; RoHS: RoHS Compliant; Category: Resistors; Stock 1: 0; Pricing 1: 1=0.15, 10=0.119, 25=0.0824, 50=0.0642, 100=0.0458, 250=0.03568, 500=0.02836, 1000=0.02012 (CAD); Packaging: Cut Tape (CT); Resistance (Ohms): 10k; Tolerance: ±5%; Composition: Thick Film; Features: Automotive AEC-Q200, Pulse Withstanding; Operating Temperature: -55°C ~ 155°C; Package / Case: 0603 (1608 Metric); Supplier Device Package: 0603 (1608 Metric); Size / Dimension: 0.063" L x 0.031" W (1.60mm x 0.80mm); Height: 0.022" (0.55mm); Number of Terminations: 2; ComponentLink1URL: http://rohmfs.rohm.com/en/products/databook/datasheet/passive/resistor/chip_resistor/esr.pdf; ComponentLink1Description: http://rohmfs.rohm.com/en/products/databook/datasheet/passive/resistor/chip_resistor/esr.pdf; Part Status: Active; Height - Seated (Max): 0.022" (0.55mm); Failure Rate: -; Supplier 1: Digi-Key; Supplier Part Number 1: 311-10KGRCT-ND
R8 = Res1: Resistor; Manufacturer: Panasonic Electronic Components; Manufacturer Part Number: ERJ-3EKF60R4V; Value: 120; Resistance (Ohms): 60.4; Tolerance: ±1%; Power (Watts): 0.1W, 1/10W; Temperature Coefficient: ±100ppm/°C; Published: 8-Jun-2000; LatestRevisionDate: 17-Jul-2002; LatestRevisionNote: Re-released for DXP Platform.; PackageReference: AXIAL-0.3; Publisher: Altium Limited; PackageDescription: Axial Device, Thru-Hole; 2 Leads; 0.3 in Pin Spacing; RoHS: RoHS Compliant; Category: Resistors; Stock 1: 113077; Pricing 1: 1=0.15, 50=0.0176, 100=0.0129, 250=0.00992, 500=0.0079, 1000=0.00583 (CAD); Packaging: Cut Tape (CT); Composition: Thick Film; Features: Automotive AEC-Q200; Operating Temperature: -55°C ~ 155°C; Package / Case: 0603 (1608 Metric); Supplier Device Package: 0603; Size / Dimension: 0.063" L x 0.031" W (1.60mm x 0.80mm); Height: 0.022" (0.55mm); Number of Terminations: 2; ComponentLink1URL: http://industrial.panasonic.com/www-cgi/jvcr13pz.cgi?E+PZ+3+AOA0002+ERJ3EKF60R4V+7+WW; ComponentLink1Description: http://industrial.panasonic.com/www-cgi/jvcr13pz.cgi?E+PZ+3+AOA0002+ERJ3EKF60R4V+7+WW; Supplier 1: Digi-Key; Supplier Part Number 1: 311-1.0KGRCT-ND

## Sheet 4d - BSPD Detection Timer.SchDoc
size A4
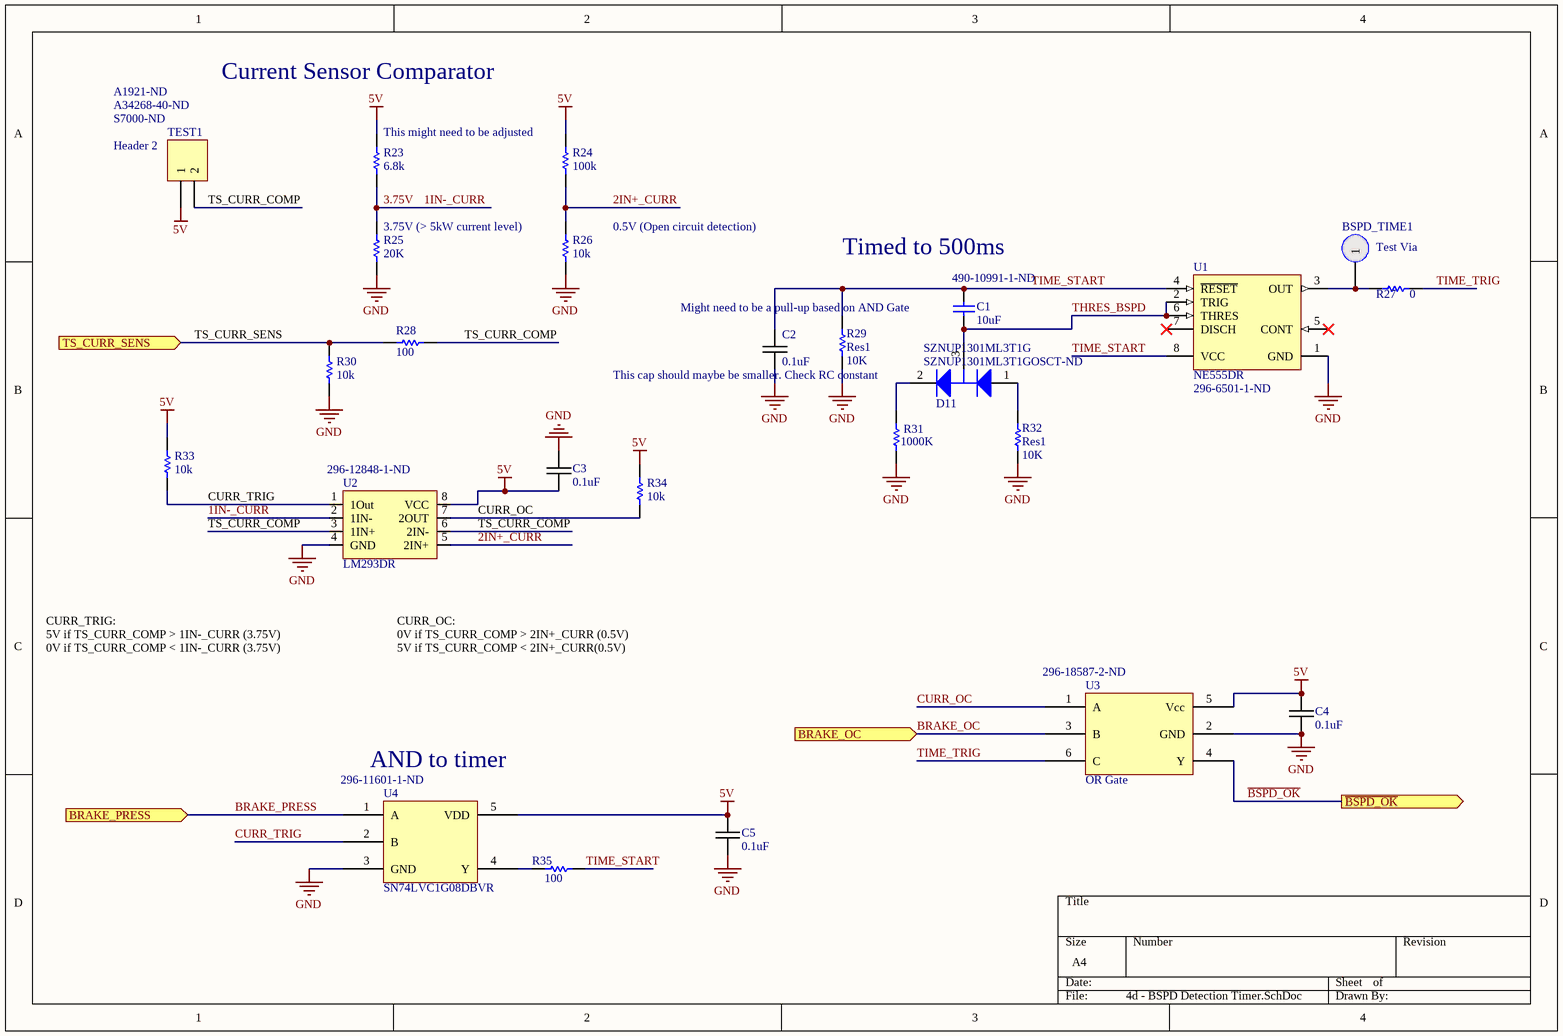
[diagram p4: 4d - BSPD Detection Timer.SchDoc]

### Parts
(Parts that share a designator on the sheet are numbered #1, #2 ... from top to bottom, then left to right.)
BSPD_TIME1  Test Via  [Test Via]
C1  value 10uF  Supplier Part Number 1: 490-10991-1-ND  [1608[0603]]  (hidden comment: Cap Semi)
C2#1  value 0.1uF  [1608[0603]]  (hidden comment: 100nF)
C3#1  value 0.1uF  [1608[0603]]  (hidden comment: 100nF)
C4#1  value 0.1uF  [1608[0603]]  (hidden comment: 100nF)
C5  value 0.1uF  [1608[0603]]  (hidden comment: 100nF)
D11  SZNUP1301ML3T1G  Supplier Part Number 1: SZNUP1301ML3T1GOSCT-ND  [ONSC-SOT-23-3-318-08_V]
R23  Resistance (Ohms): 6.8k  [1608[0603]]  (hidden comment: Volt. Div. R1)
R24  Resistance (Ohms): 100k  [1608[0603]]  (hidden comment: Volt. Div. R1)
R25  value 20K  [1608[0603]]  (hidden comment: Volt. Div. R2)
R26  value 10k  [1608[0603]]  (hidden comment: Volt. Div. R2)
R27  value 0  [1608[0603]]  (hidden comment: Volt. Div. R1)
R28  value 100  [1608[0603]]  (hidden comment: Volt. Div. R2)
R29  Res1  value 10K  [1608[0603]]
R30  value 10k  [1608[0603]]  (hidden comment: Volt. Div. R2)
R31  1000K  [RESC0603(1608)_L]
R32  Res1  value 10K  [1608[0603]]
R33  value 10k  [1608[0603]]  (hidden comment: Volt. Div. R2)
R34  value 10k  [1608[0603]]  (hidden comment: Volt. Div. R2)
R35  value 100  [1608[0603]]  (hidden comment: Volt. Div. R2)
TEST1  Header 2  Supplier Part Number 1: S7000-ND  Supplier Part Number 2: A34268-40-ND  Supplier Part Number 3: A1921-ND  [2 Pin Connector]
U1  NE555DR  Supplier Part Number 1: 296-6501-1-ND  [D0008A_M]
U2  LM293DR  Supplier Part Number 1: 296-12848-1-ND  [LM293DR]
U3#1  OR Gate  Supplier Part Number 1: 296-18587-2-ND  [SOT23-6_M]
U4  SN74LVC1G08DBVR  Supplier Part Number 1: 296-11601-1-ND  [SSOP5-P-0.95]

### Ports
BRAKE_OC (in), BRAKE_PRESS (in), TS_CURR_SENS (in), ~{BSPD_OK} (out)

### Nets
5V: C3#1.1 C4#1.1 C5.1 R23.2 R24.2 R33.2 R34.2 TEST1.1 U2.8(VCC) U3#1.5(Vcc) U4.5(VDD)
GND: C2#1.2 C3#1.2 C4#1.2 C5.2 R25.1 R26.1 R29.1 R30.1 R31.1 R32.1 U1.1(GND) U2.4(GND) U3#1.2(GND) U4.3(GND)
1IN-_CURR: R23.1 R25.2 U2.2(1IN-)  [also labelled 3.75V]
2IN+_CURR: R24.1 R26.2 U2.5(2IN+)
~{BSPD_OK}: U3#1.4(Y) ; port ~{BSPD_OK}
BRAKE_OC: U3#1.3(B) ; port BRAKE_OC
BRAKE_PRESS: U4.1(A) ; port BRAKE_PRESS
CURR_OC: R34.1 U2.7(2OUT) U3#1.1(A)
CURR_TRIG: R33.1 U2.1(1Out) U4.2(B)
THRES_BSPD: C1.1 D11.3(K/A) U1.2(TRIG) U1.6(THRES)
TIME_START: C1.2 C2#1.1 R29.2 R35.1 U1.4(~{RESET}) U1.8(VCC)
TIME_TRIG: R27.1 U3#1.6(C)
TS_CURR_COMP: R28.1 TEST1.2 U2.3(1IN+) U2.6(2IN-)
TS_CURR_SENS: R28.2 R30.2 ; port TS_CURR_SENS
NetBSPD_TIME1_1: BSPD_TIME1.1 R27.2 U1.3(OUT)
NetD11_1: D11.1(A) R32.2
NetD11_2: D11.2(K) R31.2
NetR35_2: R35.2 U4.4(Y)

Not connected (* = marked no-connect by the designer): U1 5(CONT)* 7(DISCH)*

### Notes on the sheet
- Current Sensor Comparator
- This might need to be adjusted
- (near R25) 3.75V (> 5kW current level)
- 0.5V (Open circuit detection)
- Might need to be a pull-up based on AND Gate
- (near C1) Timed to 500ms
- This cap should maybe be smaller. Check RC constant
- CURR_TRIG:
  5V if TS_CURR_COMP > 1IN-_CURR (3.75V)
  0V if TS_CURR_COMP < 1IN-_CURR (3.75V)
- CURR_OC:
  0V if TS_CURR_COMP > 2IN+_CURR (0.5V)
  5V if TS_CURR_COMP < 2IN+_CURR(0.5V)
- (near U4) AND to timer

### Library data of the parts
C1 = Cap Semi: Capacitor (Semiconductor SIM Model); Published: 8-Jun-2000; LatestRevisionDate: 29-May-2009; LatestRevisionNote: IPC-7351 Footprint Added.; PackageReference: C1206; Publisher: Altium Limited; PackageDescription: Chip Capacitor; Supplier 1: Digi-Key
C2#1 C3#1 C4#1 C5 = 0805C-100nF-25V-X7R-MUR: CAP CER 0.1UF 50V X7R 0603; Manufacturer: Kemet; Manufacturer Part Number: C0603C104K5RACAUTO; Capacitance: 0.1µF; Tolerance: ±10%; Supplier 1: Digi-Key; RoHS: RoHS Compliant; Category: Capacitors; Stock 1: 157876; Pricing 1: 1=0.14, 10=0.095, 25=0.0672, 50=0.0514, 100=0.0435, 250=0.03556, 1000=0.02324 (CAD); Packaging: Cut Tape (CT); Voltage - Rated: 50V; Temperature Coefficient: X7R; Mounting Type: Surface Mount, MLCC; Operating Temperature: -55°C ~ 125°C; Applications: Automotive; Ratings: AEC-Q200; Package / Case: 0603 (1608 Metric); Size / Dimension: 0.063" L x 0.031" W (1.60mm x 0.80mm); Height - Seated (Max): -; Thickness (Max): 0.034" (0.87mm); Lead Spacing: -; Features: -; Lead Style: -; ComponentLink1URL: http://capacitoredge.kemet.com/capedge2/DataSheet?pn=C0603C104K5RACAUTO; ComponentLink1Description: http://capacitoredge.kemet.com/capedge2/DataSheet?pn=C0603C104K5RACAUTO
  C2#1 C4#1 C5: Supplier Part Number 1: 399-6856-1-ND
D11 = CMP-1063-00171-1: Low Capacitance Diode Array for ESD Protection in a Single Data Line, 3-Pin SOT-23, Pb-Free, Tape and Reel; Manufacturer: On Semiconductor; C Max (pF): 0.9; Direction: Bidirectional; V(BR) Min (V): 70; Number of Lines: 1; Mounting Technology: Surface Mount; PackageReference: SOT-23-3-318-08; DatasheetVersion: Rev. 6; PackageVersion: Rev. AP, 11/2009; RoHS: Pb-Free; ComponentLink1Description: Manufacturer URL; ComponentLink1URL: http://www.onsemi.com/; PackageDescription: 3-Pin Small Outline Transistor, Body 2.92 x 1.3 mm, Pitch 0.95 mm; PartNumber: SZNUP1301ML3T1G; Packing: Tape and Reel; ComponentLink3URL: http://www.onsemi.cn/pub_link/Collateral/318-08.PDF; ComponentLink3Description: Package Specification; VRWM Max (V): 70; ComponentLink2Description: Datasheet; ComponentLink2URL: http://www.onsemi.cn/pub_link/Collateral/NUP1301ML3T1-D.PDF; Supplier 1: Digi-Key
R23 R24 = Res1: RES SMD 6.8K OHM 5% 1/4W 0603; Manufacturer: Rohm Semiconductor; Manufacturer Part Number: ESR03EZPJ682; Power (Watts): 0.25W, 1/4W; Temperature Coefficient: ±200ppm/°C; RoHS: RoHS Compliant; Category: Resistors; Stock 1: 2440; Pricing 1: 1=0.15, 10=0.119, 25=0.0824, 50=0.0642, 100=0.0458, 250=0.03568, 500=0.02836, 1000=0.02012 (CAD); Packaging: Cut Tape (CT); Part Status: Active; Tolerance: ±5%; Composition: Thick Film; Features: Automotive AEC-Q200, Pulse Withstanding; Operating Temperature: -55°C ~ 155°C; Package / Case: 0603 (1608 Metric); Supplier Device Package: 0603; Size / Dimension: 0.063" L x 0.031" W (1.60mm x 0.80mm); Height - Seated (Max): 0.022" (0.55mm); Failure Rate: -; ComponentLink1URL: http://rohmfs.rohm.com/en/products/databook/datasheet/passive/resistor/chip_resistor/esr.pdf; ComponentLink1Description: http://rohmfs.rohm.com/en/products/databook/datasheet/passive/resistor/chip_resistor/esr.pdf; Supplier 1: Digi-Key
  R23: Supplier Part Number 1: 311-6.8KGRCT-ND
  R24: Supplier Part Number 1: 311-100KHRCT-ND
R25 R26 R28 R30 R33-R35 = Res1: RES SMD 20K OHM 5% 1/4W 0603; Manufacturer: Rohm Semiconductor; Manufacturer Part Number: ESR03EZPJ203; Power (Watts): 0.25W, 1/4W; Temperature Coefficient: ±200ppm/°C; Published: 8-Jun-2000; LatestRevisionDate: 17-Jul-2002; LatestRevisionNote: Re-released for DXP Platform.; PackageReference: AXIAL-0.3; Publisher: Altium Limited; PackageDescription: Axial Device, Thru-Hole; 2 Leads; 0.3 in Pin Spacing; RoHS: RoHS Compliant; Category: Resistors; Stock 1: 50602; Pricing 1: 1=0.15, 10=0.121, 25=0.0832, 100=0.0463, 250=0.03604, 500=0.02866, 1000=0.02033 (CAD); Packaging: Cut Tape (CT); Resistance (Ohms): 20k; Tolerance: ±5%; Composition: Thick Film; Features: Automotive AEC-Q200, Pulse Withstanding; Operating Temperature: -55°C ~ 155°C; Package / Case: 0603 (1608 Metric); Supplier Device Package: 0603 (1608 Metric); Size / Dimension: 0.063" L x 0.031" W (1.60mm x 0.80mm); Height: 0.022" (0.55mm); Number of Terminations: 2; ComponentLink1URL: http://rohmfs.rohm.com/en/products/databook/datasheet/passive/resistor/chip_resistor/esr.pdf; ComponentLink1Description: http://rohmfs.rohm.com/en/products/databook/datasheet/passive/resistor/chip_resistor/esr.pdf; Supplier 1: Digi-Key
  R25: Supplier Part Number 1: 311-20.0KHRCT-ND
  R26 R30 R33 R34: Supplier Part Number 1: 311-10KGRCT-ND
  R28 R35: Supplier Part Number 1: 311-100HRDKR-ND
R27 = Res1: RES SMD 0.0 OHM JUMPER 1/4W 0603; Manufacturer: Vishay Dale; Manufacturer Part Number: CRCW06030000Z0EAHP; Resistance (Ohms): 0.0; Power (Watts): 0.25W, 1/4W; Published: 8-Jun-2000; LatestRevisionDate: 17-Jul-2002; LatestRevisionNote: Re-released for DXP Platform.; PackageReference: AXIAL-0.3; Publisher: Altium Limited; PackageDescription: Axial Device, Thru-Hole; 2 Leads; 0.3 in Pin Spacing; RoHS: RoHS Compliant; Category: Resistors; Stock 1: 378250; Pricing 1: 1=0.32, 10=0.272, 25=0.1972, 50=0.1432, 100=0.1062, 250=0.08152, 500=0.06422, 1000=0.04446, 2500=0.04075 (CAD); Packaging: Cut Tape (CT); Tolerance: Jumper; Composition: Thick Film; Features: Automotive AEC-Q200, Pulse Withstanding; Temperature Coefficient: -; Operating Temperature: -55°C ~ 155°C; Package / Case: 0603 (1608 Metric); Supplier Device Package: 0603 (1608 Metric); Size / Dimension: 0.063" L x 0.033" W (1.60mm x 0.85mm); Height: 0.022" (0.55mm); Number of Terminations: 2; ComponentLink1URL: http://www.vishay.com/docs/20043/crcwhpe3.pdf; ComponentLink1Description: http://www.vishay.com/docs/20043/crcwhpe3.pdf; Supplier 1: Digi-Key; Supplier Part Number 1: 311-0.0GRCT-ND
R29 R32 = Res1: as R11 on sheet 4b - Latching IMD; Published: 8-Jun-2000; LatestRevisionDate: 17-Jul-2002; LatestRevisionNote: Re-released for DXP Platform.; PackageReference: AXIAL-0.3; Publisher: Altium Limited; PackageDescription: Axial Device, Thru-Hole; 2 Leads; 0.3 in Pin Spacing; RoHS: RoHS Compliant; Category: Resistors; Stock 1: 0; Pricing 1: 1=0.15, 10=0.119, 25=0.0824, 50=0.0642, 100=0.0458, 250=0.03568, 500=0.02836, 1000=0.02012 (CAD); Packaging: Cut Tape (CT); Part Status: Active; Resistance (Ohms): 10k; Tolerance: ±5%; Composition: Thick Film; Features: Automotive AEC-Q200, Pulse Withstanding; Operating Temperature: -55°C ~ 155°C; Package / Case: 0603 (1608 Metric); Supplier Device Package: 0603; Size / Dimension: 0.063" L x 0.031" W (1.60mm x 0.80mm); Height - Seated (Max): 0.022" (0.55mm); Failure Rate: -; ComponentLink1URL: http://rohmfs.rohm.com/en/products/databook/datasheet/passive/resistor/chip_resistor/esr.pdf; ComponentLink1Description: http://rohmfs.rohm.com/en/products/databook/datasheet/passive/resistor/chip_resistor/esr.pdf; Supplier 1: Digi-Key; Supplier Part Number 1: 311-10KGRCT-ND
R31 = CMP-1591-00001-1: as R9 on sheet 4b - Latching IMD; PackageReference: RESC0603(1608); Supplier 1: Digi-Key; Supplier Part Number 1: 311-1.00MHRCT-ND
TEST1 = Header 2: as JMP1 on sheet 4  - Latching; LatestRevisionDate: 17-Jul-2002; LatestRevisionNote: Re-released for DXP Platform.; Publisher: Altium Limited; RoHS: RoHS Compliant; Category: Connectors, Interconnects; Packaging: Bulk; Part Status: Active; Contact Type: Male Pin; Number of Rows: 1; Row Spacing - Mating: -; Mounting Type: Through Hole; Termination: Solder; Fastening Type: Push-Pull; Insulation Height: 0.100" (2.54mm); Contact Shape: Square; Contact Finish - Mating: Tin; Contact Finish Thickness - Mating: -; Contact Finish - Post: Tin; Contact Material: Brass; Insulation Material: Polyamide (PA6T), Nylon 6T; Features: -; Operating Temperature: -40°C ~ 105°C; Ingress Protection: -; Insulation Color: Black; Voltage Rating: -; Contact Finish Thickness - Post: -; Applications: -; ComponentLink1URL: https://cdn.harwin.com/pdfs/M20-999.pdf; ComponentLink1Description: https://cdn.harwin.com/pdfs/M20-999.pdf; Supplier 1: Digi-Key; Supplier 2: Digi-Key; Supplier 3: Digi-Key
U1 = CMP-1685-00007-1: Precision Timer, 4.5 to 16 V, 0 to 70 degC, 8-Pin SOIC (D8), Green (RoHS & no Sb/Br), Tape and Reel; Forward Voltage: 450 mV; Forward Current: 1 A; Max Surge Current: 30 A; Peak Reverse Current: 500 uA; Case\Package: SMA; PackageReference: D0008A; Width: 2.84 mm; PackageDescription: 8-Pin Small Outline Integrated Circuit, Body 4.9 x 3.9 mm, Pitch 1.27 mm; DatasheetVersion: SLFS022I, 09/2014; ComponentLink2Description: Datasheet; Package Quantity: 1; REACH SVHC: Unknown; Radiation Hardening: No; Height: 2.44 mm; Code_JEDEC: MS-012; Pins: 2; ComponentLink1Description: Manufacturer URL; ComponentLink3Description: Package Specification; ComponentLink3URL: http://www.ti.com/lit/ml/msoi002j/msoi002j.pdf; Length: 4.57 mm; ComponentLink1URL: http://www.ti.com/; Mount: Surface Mount; PackageVersion: 4040047-3/M, 06/2011; ComponentLink2URL: http://www.ti.com/general/docs/lit/getliterature.tsp?genericPartNumber=NE555&fileType=pdf; RoHSCompliant: true; Max Operating Temperature: 125 degC; Packaging: Cut Tape; Min Operating Temperature: -55 degC; Supplier 1: Digi-Key
U2 = LM293DR: IC Dual Comparator; Supplier 1: Digi-Key
U3#1 = 4-input OR Gate: Supplier 1: Digi-Key
U4 = SN74LVC1G08DBVR: Supplier 1: Digi-Key